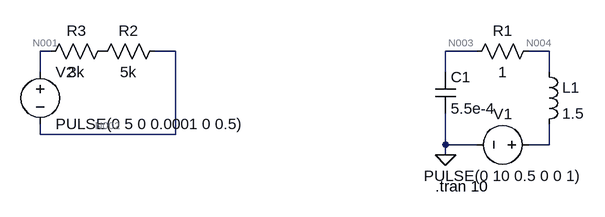
[diagram p0: schematic resonanceLC.asc]
resonanceLC.asc, the LTspice schematic file:
Version 4
SHEET 1 880 680
WIRE -496 96 -512 96
WIRE -304 96 -336 96
WIRE 160 96 112 96
WIRE 272 96 240 96
WIRE -512 128 -512 96
WIRE 112 128 112 96
WIRE 272 128 272 96
WIRE -512 224 -512 208
WIRE -304 224 -304 96
WIRE -304 224 -512 224
WIRE 112 240 112 192
WIRE 160 240 112 240
WIRE 272 240 272 208
WIRE 272 240 240 240
WIRE 112 256 112 240
FLAG 112 256 0
SYMBOL cap 96 128 R0
SYMATTR InstName C1
SYMATTR Value 5.5e-4
SYMBOL ind 256 112 R0
SYMATTR InstName L1
SYMATTR Value 1.5
SYMBOL voltage 256 240 R90
WINDOW 0 -32 56 VBottom 2
WINDOW 3 32 56 VTop 2
WINDOW 123 0 0 Left 0
WINDOW 39 0 0 Left 0
SYMATTR InstName V1
SYMATTR Value PULSE(0 10 0.5 0 0 1)
SYMBOL res 256 80 R90
WINDOW 0 0 56 VBottom 2
WINDOW 3 32 56 VTop 2
SYMATTR InstName R1
SYMATTR Value 1
SYMBOL voltage -512 112 R0
WINDOW 123 0 0 Left 0
WINDOW 39 0 0 Left 0
SYMATTR InstName V2
SYMATTR Value PULSE(0 5 0 0.0001 0 0.5)
SYMBOL res -320 80 R90
WINDOW 0 0 56 VBottom 2
WINDOW 3 32 56 VTop 2
SYMATTR InstName R2
SYMATTR Value 5k
SYMBOL res -400 80 R90
WINDOW 0 0 56 VBottom 2
WINDOW 3 32 56 VTop 2
SYMATTR InstName R3
SYMATTR Value 3k
TEXT 96 304 Left 2 !.tran 10

The netlist it stands for:
* resonanceLC.asc
C1 N003 0 5.5e-4
L1 N004 N005 1.5
V1 N005 0 PULSE(0 10 0.5 0 0 1)
R1 N004 N003 1
V2 N001 N002 PULSE(0 5 0 0.0001 0 0.5)
R2 N002 P001 5k
R3 P001 N001 3k
.tran 10
.backanno
.end

* Results of the author's LTspice run, read from the files saved beside the schematic
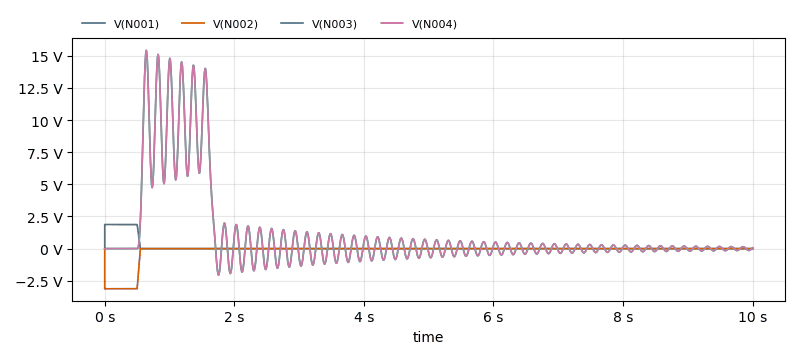
[diagram p1: Transient Analysis of resonanceLC.asc, plotted from the saved traces]
* Transient Analysis, 1 run:
*   V(N001): min 0 V, max 1.875 V, average 98.45 mV, rms 426.3 mV, last 0 V
*   V(N002): min -3.125 V, max 0 V, average -164.1 mV, rms 710.5 mV, last 0 V
*   V(N003): min -2.057 V, max 15.42 V, average 1.099 V, rms 3.529 V, last 55.79 mV
*   V(N004): min -2.056 V, max 15.42 V, average 1.099 V, rms 3.529 V, last 58.28 mV